# EasyEDA schematic SCH_Potensiometers_2024-04-15.json
TITLE: Sheet_1; REV: 1.0; Date: 2024-04-15; Sheet: 1/1; Drawn By: tamir3; Company: Your Company
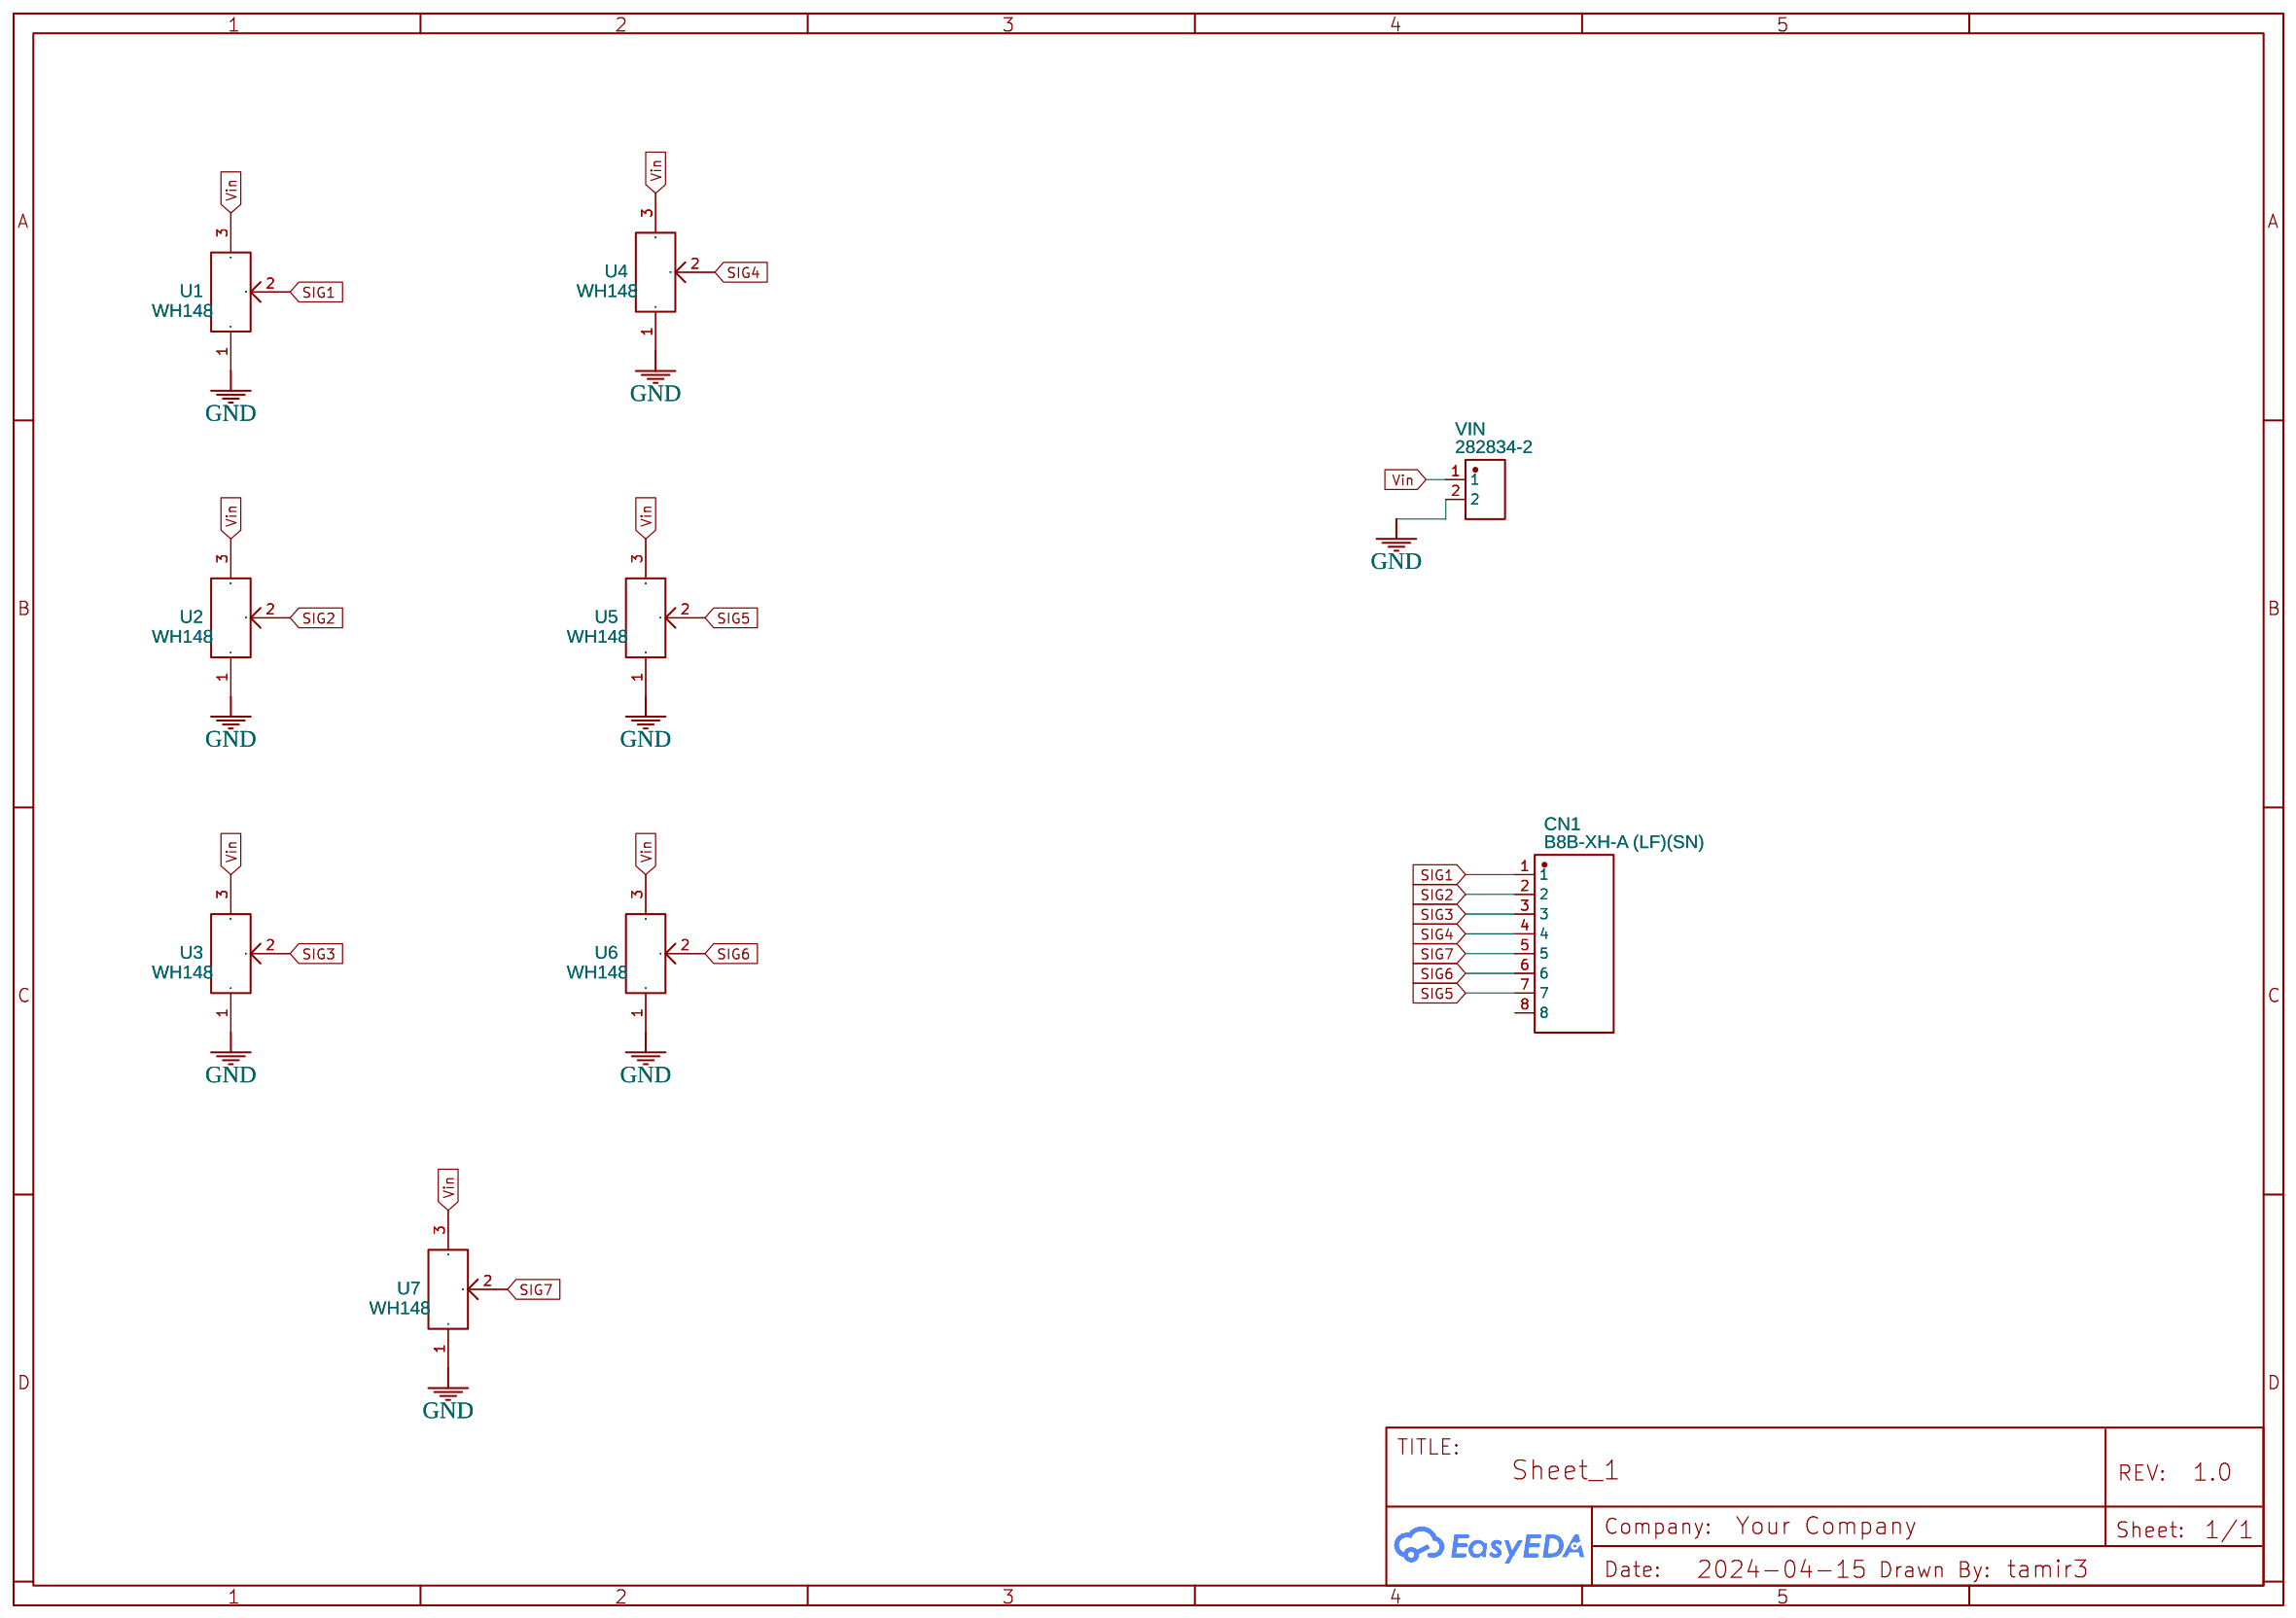
[diagram p0: schematic sheet]

## Parts
CN1  B8B-XH-A (LF)(SN)  [CONN-TH_B8B-XH-A-LF-SN]
U1  WH148  [WH148]
U2  WH148  [WH148]
U3  WH148  [WH148]
U4  WH148  [WH148]
U5  WH148  [WH148]
U6  WH148  [WH148]
U7  WH148  [WH148]
VIN  282834-2  [CONN-TH_2P-P2.54_282834-2]

## Library data of the parts
CN1 = B8B-XH-A (LF)(SN): Contributor: LCSC; Supplier: LCSC; Supplier Part: C157972; Manufacturer: JST; Manufacturer Part: B8B-XH-A(LF)(SN); JLCPCB Part Class: Extended Part
U1-U7 = WH148 POTENZIOMETRO A SALDARE ORIZZONTALE: Supplier: ANDREA; Contributor: andreabrunella84
VIN = 282834-2: Contributor: lcsc; Supplier: LCSC; Supplier Part: C592983; Manufacturer: TE Connectivity(泰科电子); JLCPCB Part Class: Extended Part

## Nets
GND: U1.1(T1) U2.1(T1) U3.1(T1) U4.1(T1) U5.1(T1) U6.1(T1) U7.1(T1) VIN.2
Vin: U1.3(T3) U2.3(T3) U3.3(T3) U4.3(T3) U5.3(T3) U6.3(T3) U7.3(T3) VIN.1
SIG1: CN1.1 U1.2(T2)
SIG2: CN1.2 U2.2(T2)
SIG3: CN1.3 U3.2(T2)
SIG4: CN1.4 U4.2(T2)
SIG5: CN1.7 U5.2(T2)
SIG6: CN1.6 U6.2(T2)
SIG7: CN1.5 U7.2(T2)

Not connected (* = marked no-connect by the designer): CN1 8
